# Altium schematic sheet PRESS.SchDoc
size A4
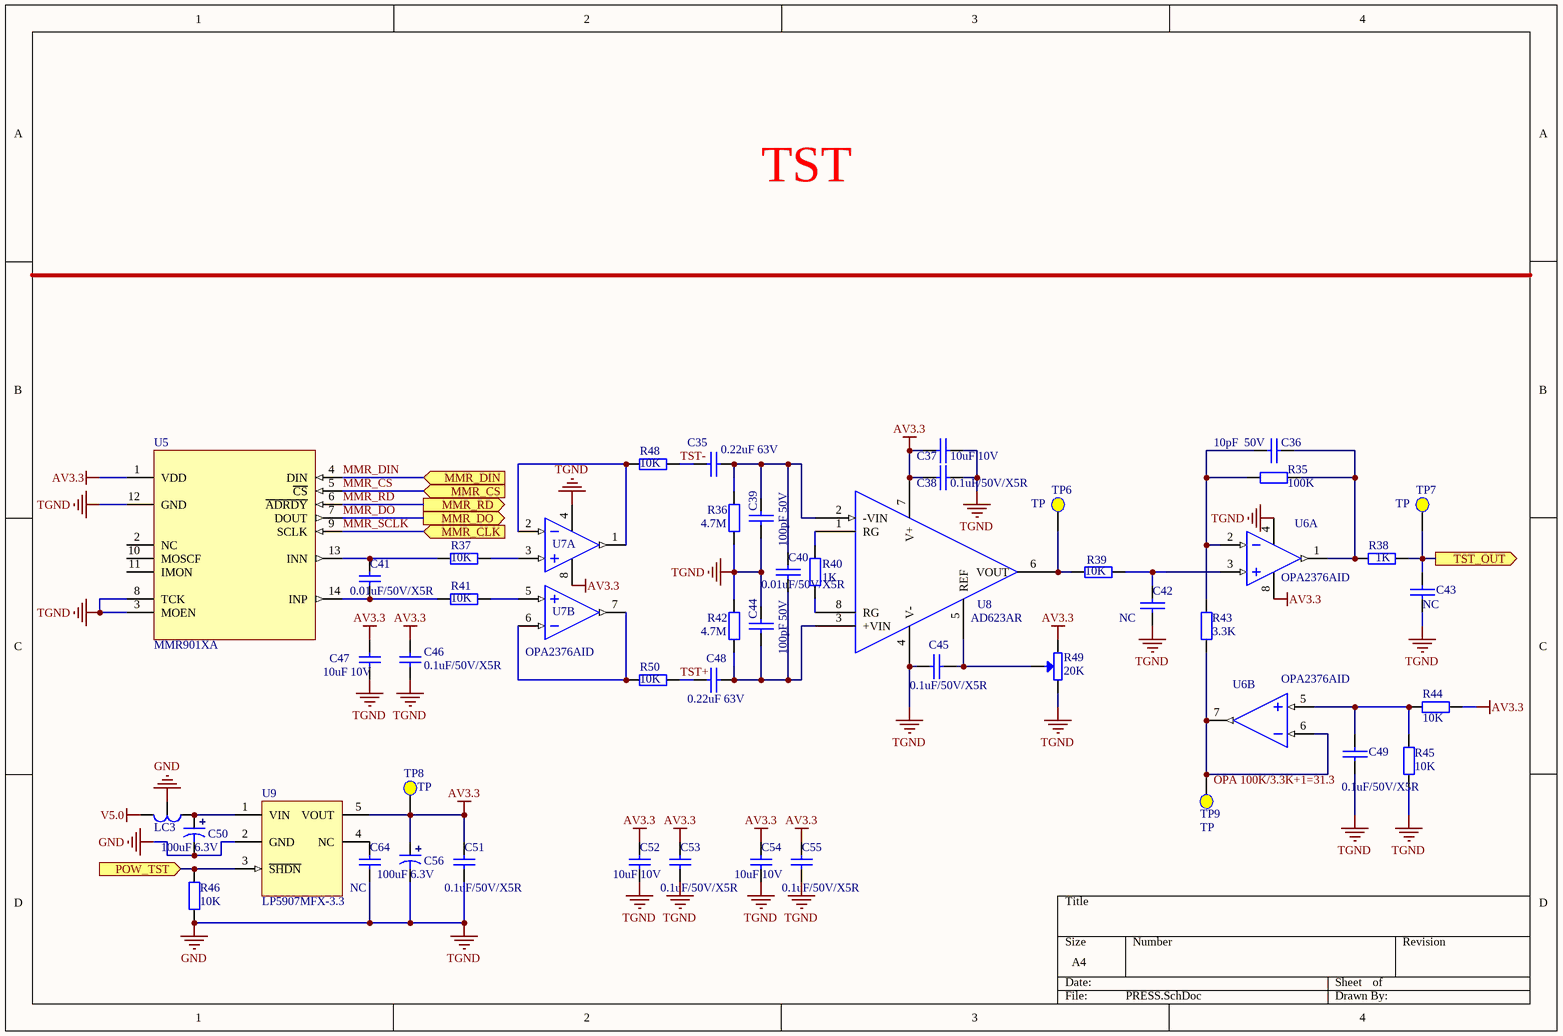
[diagram p0: PRESS.SchDoc]

## Parts
C35  0.22uF 63V  [CAP-7.5*5.08]
C36  10pF  50V  [SMD-0603C]
C37  10uF 10V  [SMD-0603C]
C38  0.1uF/50V/X5R  [SMD-0603C]
C39  100pF 50V  [SMD-0603C]
C40  0.01uF/50V/X5R  [SMD-0603C]
C41  0.01uF/50V/X5R  [SMD-0603C]
C42  NC  [SMD-0603C]
C43  NC  [SMD-0603C]
C44  100pF 50V  [SMD-0603C]
C45  0.1uF/50V/X5R  [SMD-0603C]
C46  0.1uF/50V/X5R  [SMD-0603C]
C47  10uF 10V  [SMD-0603C]
C48  0.22uF 63V  [CAP-7.5*5.08]
C49  0.1uF/50V/X5R  [SMD-0603C]
C50  100uF 6.3V  [SMD-3528-B]
C51  0.1uF/50V/X5R  [SMD-0603C]
C52  10uF 10V  [SMD-0603C]
C53  0.1uF/50V/X5R  [SMD-0603C]
C54  10uF 10V  [SMD-0603C]
C55  0.1uF/50V/X5R  [SMD-0603C]
C56  100uF 6.3V  [SMD-3528-B]
C64  NC  [SMD-0603C]
LC3  NFM18PC104R1C3  [NFM21P-0805]  (value not drawn)
R35  100K  [SMD-0603]
R36  4.7M  [SMD-0603]
R37  10K  [SMD-0603]
R38  1K  [SMD-0603]
R39  10K  [SMD-0603]
R40  1K  [SMD-0603]
R41  10K  [SMD-0603]
R42  4.7M  [SMD-0603]
R43  3.3K  [SMD-0603]
R44  10K  [SMD-0603]
R45  10K  [SMD-0603]
R46  10K  [SMD-0603]
R48  10K  [SMD-0603]
R49  20K  [VR-05]
R50  10K  [SMD-0603]
TP6  TP  [TP]
TP7  TP  [TP]
TP8  TP  [TP]
TP9  TP  [TP]
U5  MMR901XA  [MMR901XA]
U6  OPA2376AID  [SOIC-8]  (parts A,B of 2)
U7  OPA2376AID  [SOIC-8]  (parts A,B of 2)
U8  AD623AR  [SOIC-8]
U9  LP5907MFX-3.3  [SOT23-5]

## Ports
MMR_CLK (in), MMR_CS (in), MMR_DIN (in), MMR_DO (out), MMR_RD (out), POW_TST (in), TST_OUT (out)

## Nets
AV3.3: C37.2 C38.2 C46.2 C47.2 C51.2 C52.2 C53.2 C54.2 C55.2 C56.1 R44.1 R49.3 TP8.1(TP) U5.1(VDD) U6.8(V+) U7.8(V+) U8.7(V+) U9.5(VOUT)
GND: C37.1 C38.1 C39.2 C42.1 C43.2 C44.1 C45.1 C46.1 C47.1 C49.1 C50.2 C51.1 C52.1 C53.1 C54.1 C55.1 C56.2 C64.1 LC3.2 R36.2 R42.1 R45.1 R46.2 R49.1 U5.3(MOEN) U5.8(TCK) U5.12(GND) U6.4(V-) U7.4(V-) U8.4(V-) U9.2(GND)  [also labelled TGND]
V5.0: LC3.3
MMR_CS: U5.5(~{CS}) ; port MMR_CS
MMR_DIN: U5.4(DIN) ; port MMR_DIN
MMR_DO: U5.7(DOUT) ; port MMR_DO
MMR_RD: U5.6(~{ADRDY}) ; port MMR_RD
MMR_SCLK: U5.9(SCLK) ; port MMR_CLK
POW_TST: R46.1 U9.3(~{SHDN}) ; port POW_TST
TST+: C48.2 R50.1
TST-: C35.1 R48.1
TST_OUT: C43.1 R38.2 TP7.1(TP) ; port TST_OUT
NetC35_2: C35.2 C39.1 C40.1 R36.1 U8.2(-VIN)
NetC36_1: C36.1 R35.1 R43.2 U6.2(IN1-)
NetC36_2: C36.2 R35.2 R38.1 U6.1(OUT1)
NetC40_2: C40.2 C44.2 C48.1 R42.2 U8.3(+VIN)
NetC41_1: C41.1 R41.2 U5.14(INP)
NetC41_2: C41.2 R37.2 U5.13(INN)
NetC42_2: C42.2 R39.2 U6.3(IN1+)
NetC45_2: C45.2 R49.2 U8.5(REF)
NetC49_2: C49.2 R44.2 R45.2 U6.5(IN2+)
NetC50_1: C50.1 LC3.1 U9.1(VIN)
NetC64_2: C64.2 U9.4(NC)
NetR37_1: R37.1 U7.3(IN1+)
NetR39_1: R39.1 TP6.1(TP) U8.6(VOUT)
NetR40_1: R40.1 U8.1(RG)
NetR40_2: R40.2 U8.8(RG)
NetR41_1: R41.1 U7.5(IN2+)
NetR43_1: R43.1 TP9.1(TP) U6.6(IN2-) U6.7(OUT2)
NetR48_2: R48.2 U7.1(OUT1) U7.2(IN1-)
NetR50_2: R50.2 U7.6(IN2-) U7.7(OUT2)

Not connected (* = marked no-connect by the designer): U5 2(NC) 10(MOSCF) 11(IMON)

## Notes on the sheet
- TST
- OPA 100K/3.3K+1=31.3

## Library data of the parts
C35 C48 = CAP: CBB电容
C36 C38-C40 C42-C45 C49 = CAP: 贴片电容 5%
C37 = CAP: 贴片电容 20%
C41 C46 C51 C53 C55 C64 = CAP4: 贴片电容 10%
C47 C52 C54 = CAP4: 贴片电容 20%
C50 C56 = CAP2: 钽电容
LC3 = SMD-EMIFIL-0603: LC滤波器
R35-R43 R46 R48 R50 = RES0: 贴片电阻 1%
R44 R45 = RES0: 贴片电阻 1% 低温票电阻
R49 = RES4: 可调电阻
TP6-TP9 = TP_POINT
U5 = MMR901: 压力传感器
U6 = LM358: 运放
U7 = LM358: 高精度运放
U8 = Component_1: 仪表运放; Part Field 1: 0; Part Field 2: 0
U9 = MCP1802: LDO